# EAGLE design Spannungsversorgung_V3 (EAGLE 9.6.2)
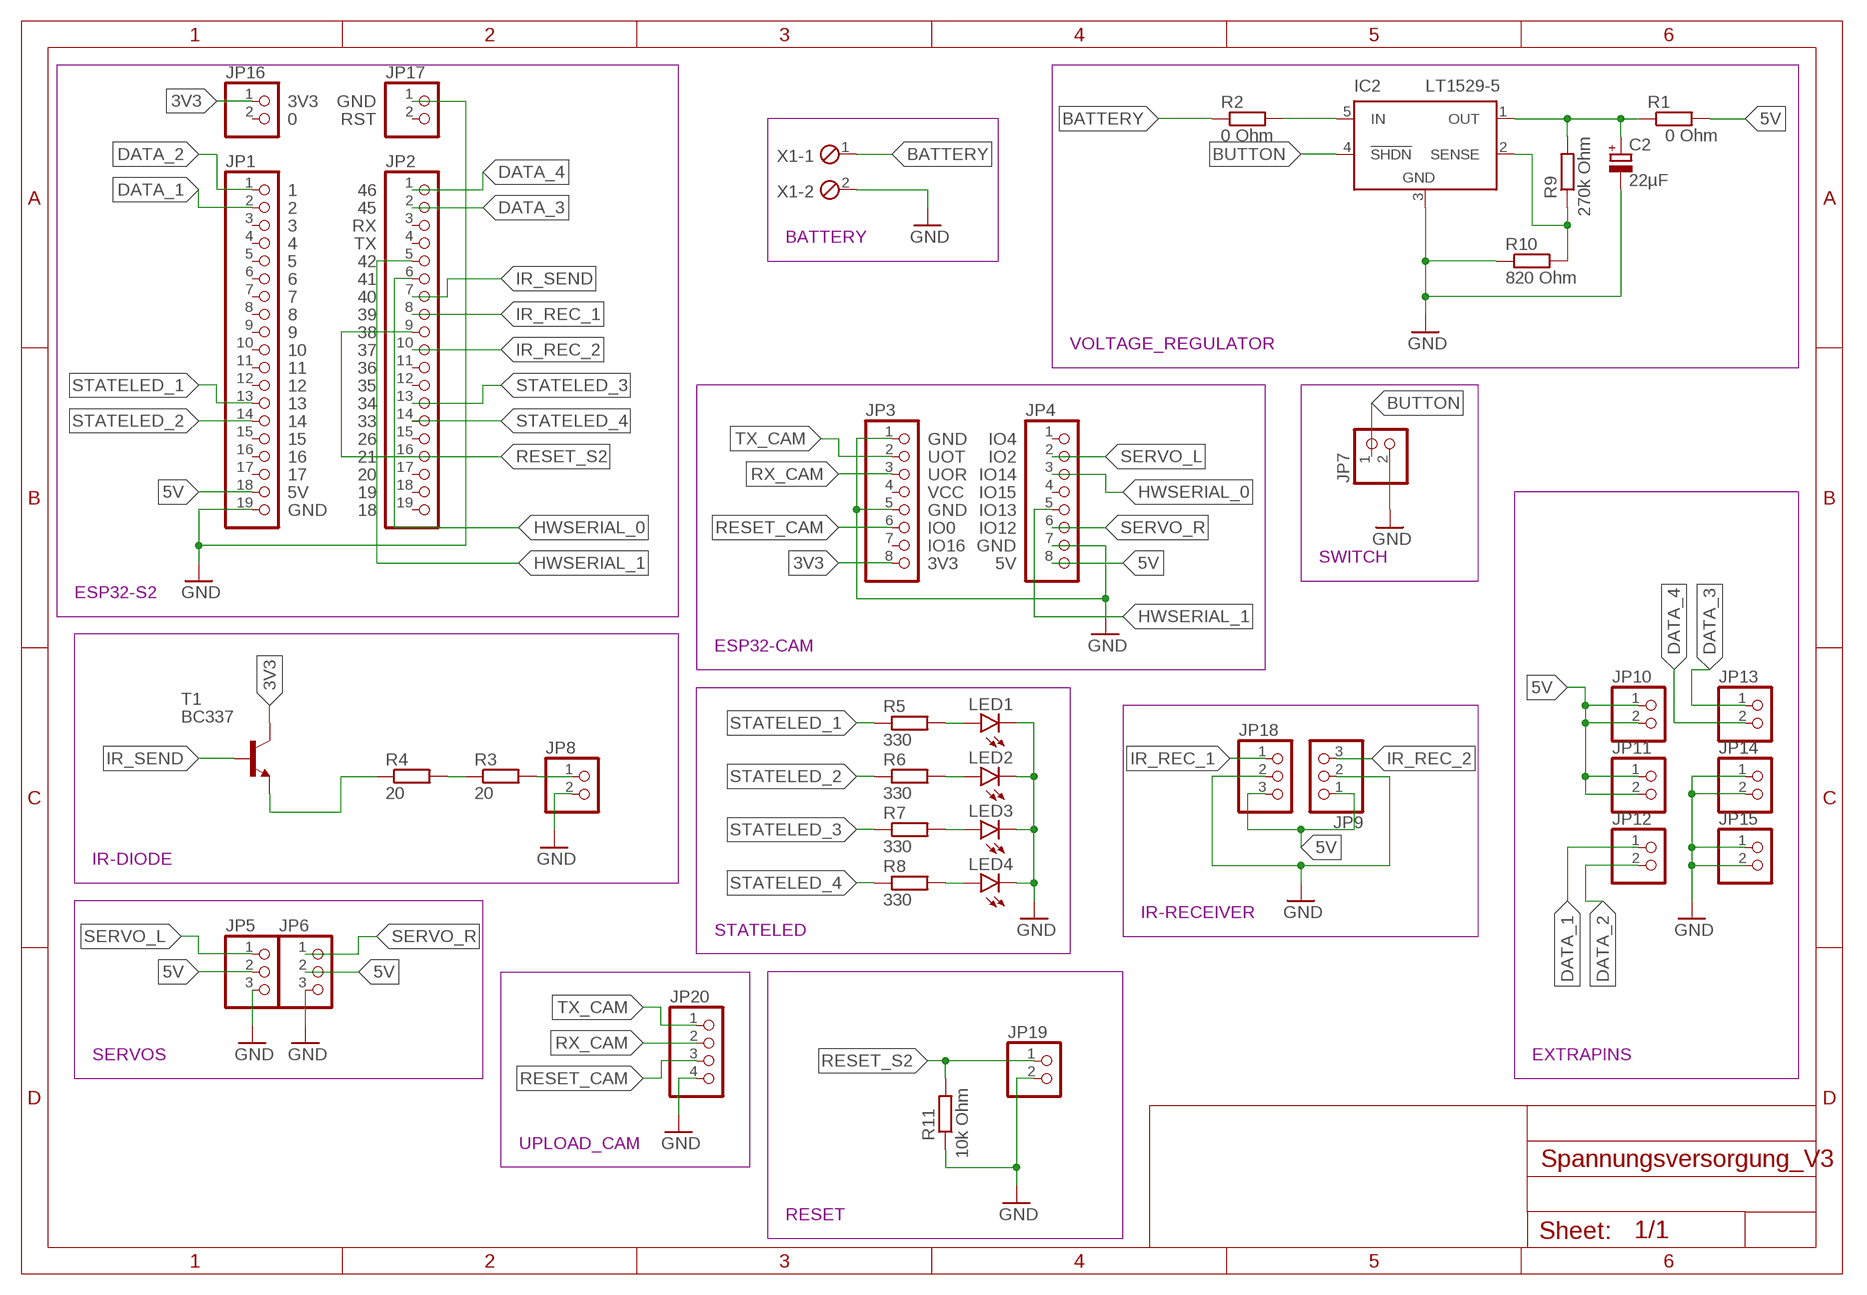
[diagram p0: schematic, sheet 1]

## Parts
C2  22µF  CPOL-EUE2.5-5  [E2,5-5]
IC2  LT1529-5  LT1529T  [TO220-5]
JP1  PINHD-1X19  [1X19]
JP2  PINHD-1X19  [1X19]
JP3  PINHD-1X8  [1X08]
JP4  PINHD-1X8  [1X08]
JP5  PINHD-1X3  [1X03]
JP6  PINHD-1X3  [1X03]
JP7  PINHD-1X2  [1X02]
JP8  PINHD-1X2  [1X02]
JP9  PINHD-1X3  [1X03]
JP10  PINHD-1X2  [1X02]
JP11  PINHD-1X2  [1X02]
JP12  PINHD-1X2  [1X02]
JP13  PINHD-1X2  [1X02]
JP14  PINHD-1X2  [1X02]
JP15  PINHD-1X2  [1X02]
JP16  PINHD-1X2  [1X02]
JP17  PINHD-1X2  [1X02]
JP18  PINHD-1X3  [1X03]
JP19  PINHD-1X2  [1X02]
JP20  PINHD-1X4  [1X04]
LED1  LED3MM  [LED3MM]
LED2  LED3MM  [LED3MM]
LED3  LED3MM  [LED3MM]
LED4  LED3MM  [LED3MM]
R1  0 Ohm  R-EU_R0805  [R0805]
R2  0 Ohm  R-EU_R0805  [R0805]
R3  20  R-EU_0309/12  [0309/12]
R4  20  R-EU_0309/12  [0309/12]
R5  330  R-EU_R0805  [R0805]
R6  330  R-EU_R0805  [R0805]
R7  330  R-EU_R0805  [R0805]
R8  330  R-EU_R0805  [R0805]
R9  270k Ohm  R-EU_0309/12  [0309/12]
R10  820 Ohm  R-EU_0309/12  [0309/12]
R11  10k Ohm  R-EU_0309/12  [0309/12]
T1  BC337  [TO92]
X1  MPT2  [2POL254]

## Nets
3V3: JP3.8 JP16.1 T1.3(C)
5V: JP1.18 JP4.8 JP5.2 JP6.2 JP9.1 JP10.1 JP10.2 JP11.1 JP11.2 JP18.3 R1.2
BATTERY: R2.1 X1.1
BUTTON: IC2.4(!SHDN) JP7.1
DATA_1: JP1.2 JP12.1
DATA_2: JP1.1 JP12.2
DATA_3: JP2.2 JP13.1
DATA_4: JP2.1 JP13.2
GND: C2.- IC2.3(GND) JP1.19 JP3.1 JP3.5 JP4.7 JP5.3 JP6.3 JP7.2 JP8.2 JP9.2 JP14.1 JP14.2 JP15.1 JP15.2 JP17.1 JP18.2 JP19.2 JP20.4 LED1.K(C) LED2.K(C) LED3.K(C) LED4.K(C) R10.1 R11.1 X1.2
HWSERIAL_0: JP2.6 JP4.3
HWSERIAL_1: JP2.5 JP4.5
IR_REC_1: JP2.8 JP18.1
IR_REC_2: JP2.10 JP9.3
IR_SEND: JP2.7 T1.2(B)
N$1: R3.1 R4.2
N$2: JP8.1 R3.2
N$3: IC2.5(IN) R2.2
N$5: LED1.A R5.2
N$6: LED2.A R6.2
N$7: LED3.A R7.2
N$8: LED4.A R8.2
N$11: R4.1 T1.1(E)
N$13: IC2.2(SENSE) R9.1 R10.2
N$14: C2.+ IC2.1(OUT) R1.1 R9.2
RESET_CAM: JP3.6 JP20.3
RESET_S2: JP2.9 JP19.1 R11.2
RX_CAM: JP3.3 JP20.2
SERVO_L: JP4.2 JP5.1
SERVO_R: JP4.6 JP6.1
STATELED_1: JP1.13 R5.1
STATELED_2: JP1.14 R6.1
STATELED_3: JP2.13 R7.1
STATELED_4: JP2.14 R8.1
TX_CAM: JP3.2 JP20.1
Unconnected: JP1.3 JP1.4 JP1.5 JP1.6 JP1.7 JP1.8 JP1.9 JP1.10 JP1.11 JP1.12 JP1.15 JP1.16 JP1.17 JP2.3 JP2.4 JP2.11 JP2.12 JP2.15 JP2.16 JP2.17 JP2.18 JP2.19 JP3.4 JP3.7 JP4.1 JP4.4 JP16.2 JP17.2

## Notes on the sheet
- 3V3 | GND
- 0 | RST
- 1 | 46
- 2 | 45
- 3 | RX
- BATTERY
- 4 | TX
- 5 | 42
- 6 | 41
- 7 | 40
- 8 | 39
- 9 | 38
- VOLTAGE_REGULATOR
- 10 | 37
- 11 | 36
- 12 | 35
- 13 | 34
- 14 | 33
- 15 | 26 | GND | IO4
- 16 | 21 | UOT | IO2
- 17 | 20 | UOR | IO14
- 5V | 19 | VCC | IO15
- GND | 18 | GND | IO13
- IO0 | IO12
- IO16 | GND
- SWITCH
- 3V3 | 5V
- ESP32-S2
- ESP32-CAM
- IR-DIODE
- IR-RECEIVER
- STATELED
- SERVOS | EXTRAPINS
- UPLOAD_CAM
- RESET

## Library data of the parts
C2 = rcl:CPOL-EU: POLARIZED CAPACITOR, European symbol; SPICEPREFIX: C
IC2 = ltc1440_lt1529_ds1302:LT1529: LT1529 5 Volt LDO Regulator 5 Volt, 3 Ampere Low Dropout voltage regulator.
JP1 JP2 = pinhead:PINHD-1X19: PIN HEADER
JP3 JP4 = pinhead:PINHD-1X8: PIN HEADER
JP5 JP6 JP9 JP18 = pinhead:PINHD-1X3: PIN HEADER
JP7 JP8 JP10-JP17 JP19 = pinhead:PINHD-1X2: PIN HEADER
JP20 = pinhead:PINHD-1X4: PIN HEADER
LED1-LED4 = led:LED: LED OSRAM: - CHIPLED LG R971, LG N971, LY N971, LG Q971, LY Q971, LO R971, LY R971 LH N974, LH R974 LS Q976, LO Q976, LY Q976 LO Q996 - Hyper CHIPLED LW Q18S LB Q993, LB Q99A, LB R99A - SideLED LS A670, LO A670, LY A670, LG A670, LP A670 LB A673, LV A673, LT A673, LW A673 LH A674 LY A675 LS A676, LA A676, LO A676, LY A676, LW A676 LS A679, LY A679, LG A679 - Hyper Micro SIDELED® LS Y876, LA Y876, LO Y876, LY Y876 LT Y87S - SmartLED LW L88C, LW L88S LB L89C, LB L89S, LG L890 LS L89K, LO L89K, LY L89K LS L896, LA L896, LO L896, LY L896 - TOPLED LS T670, LO T670, LY T670, LG T670, LP T670 LSG T670, LSP T670, LSY T670, LOP T670, LYG T670 LG T671, LOG T671, LSG T671 LB T673, LV T673, LT T673, LW T673 LH T674 LS T676, LA T676, LO T676, LY T676, LB T676, LH T676, LSB T676, LW T676 LB T67C, LV T67C, LT T67C, LS T67K, LO T67K, LY T67K, LW E67C LS E67B, LA E67B, LO E67B, LY E67B, LB E67C, LV E67C, LT E67C LW T67C LS T679, LY T679, LG T679 LS T770, LO T770, LY T770, LG T770, LP T770 LB T773, LV T773, LT T773, LW T773 LH T774 LS E675, LA E675, LY E675, LS T675 LS T776, LA T776, LO T776, LY T776, LB T776 LHGB T686 LT T68C, LB T68C - Hyper Mini TOPLED® LB M676 - Mini TOPLED Santana® LG M470 LS M47K, LO M47K, LY M47K Source: http://www.osram.convergy.de LUXEON: - LUMILED® LXK2-PW12-R00, LXK2-PW12-S00, LXK2-PW14-U00, LXK2-PW14-V00 LXK2-PM12-R00, LXK2-PM12-S00, LXK2-PM14-U00 LXK2-PE12-Q00, LXK2-PE12-R00, LXK2-PE12-S00, LXK2-PE14-T00, LXK2-PE14-U00 LXK2-PB12-K00, LXK2-PB12-L00, LXK2-PB12-M00, LXK2-PB14-N00, LXK2-PB14-P00, LXK2-PB14-Q00 LXK2-PR12-L00, LXK2-PR12-M00, LXK2-PR14-Q00, LXK2-PR14-R00 LXK2-PD12-Q00, LXK2-PD12-R00, LXK2-PD12-S00 LXK2-PH12-R00, LXK2-PH12-S00 LXK2-PL12-P00, LXK2-PL12-Q00, LXK2-PL12-R00 Source: www.luxeon.com KINGBRIGHT: KA-3528ASYC Source: www.kingbright.com
R1-R11 = rcl:R-EU_: RESISTOR, European symbol; SPICEPREFIX: R
T1 = transistor:BC337: NPN TRANSISTOR
X1 = con-phoenix-254:MPT2: PHOENIX CONNECTOR; OC_FARNELL: unknown; OC_NEWARK: unknown

## Board
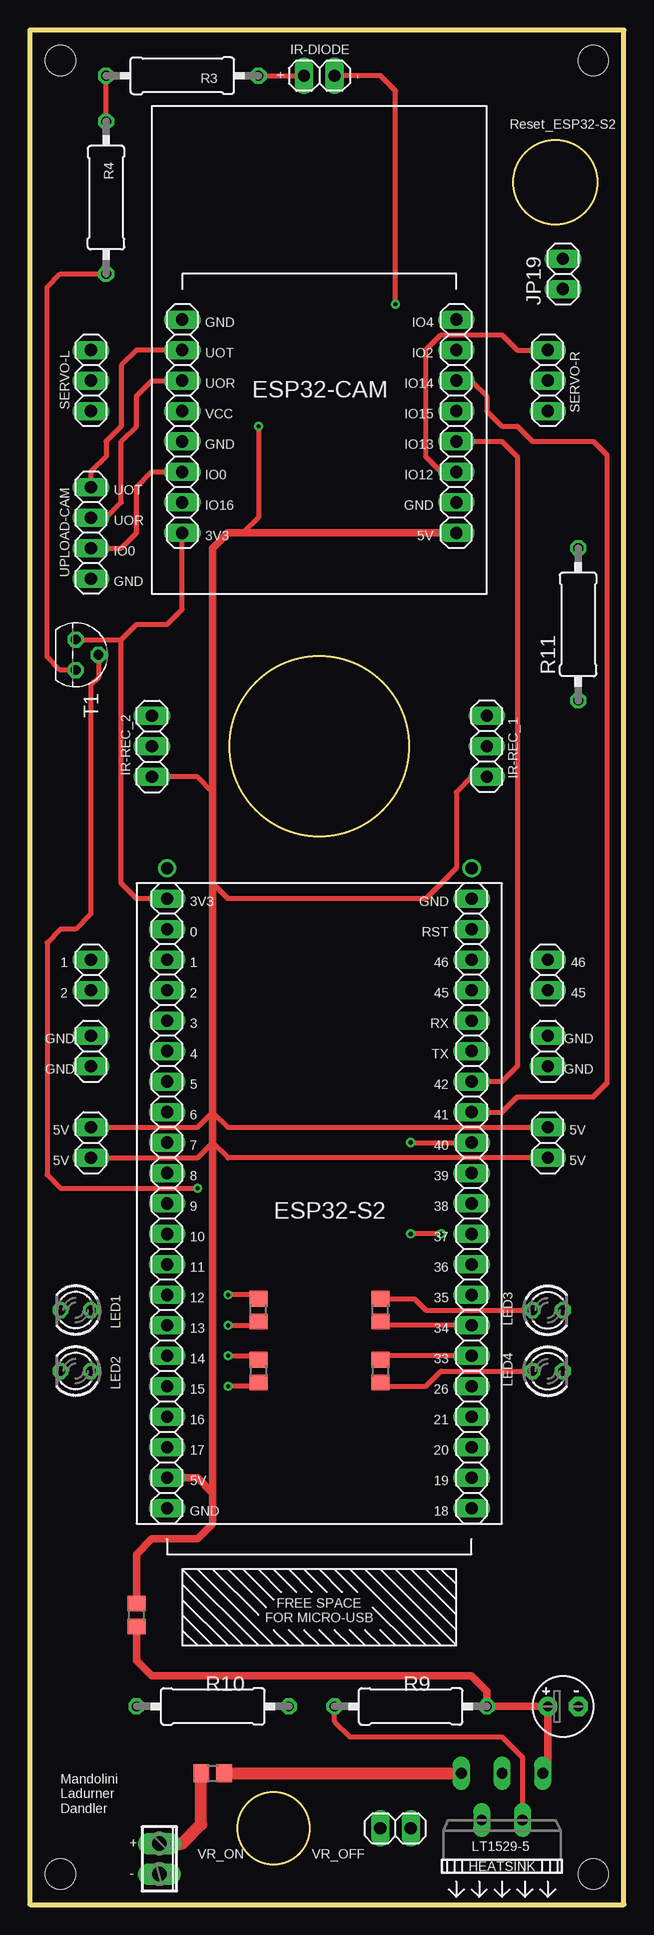
[diagram p1: board, top side]
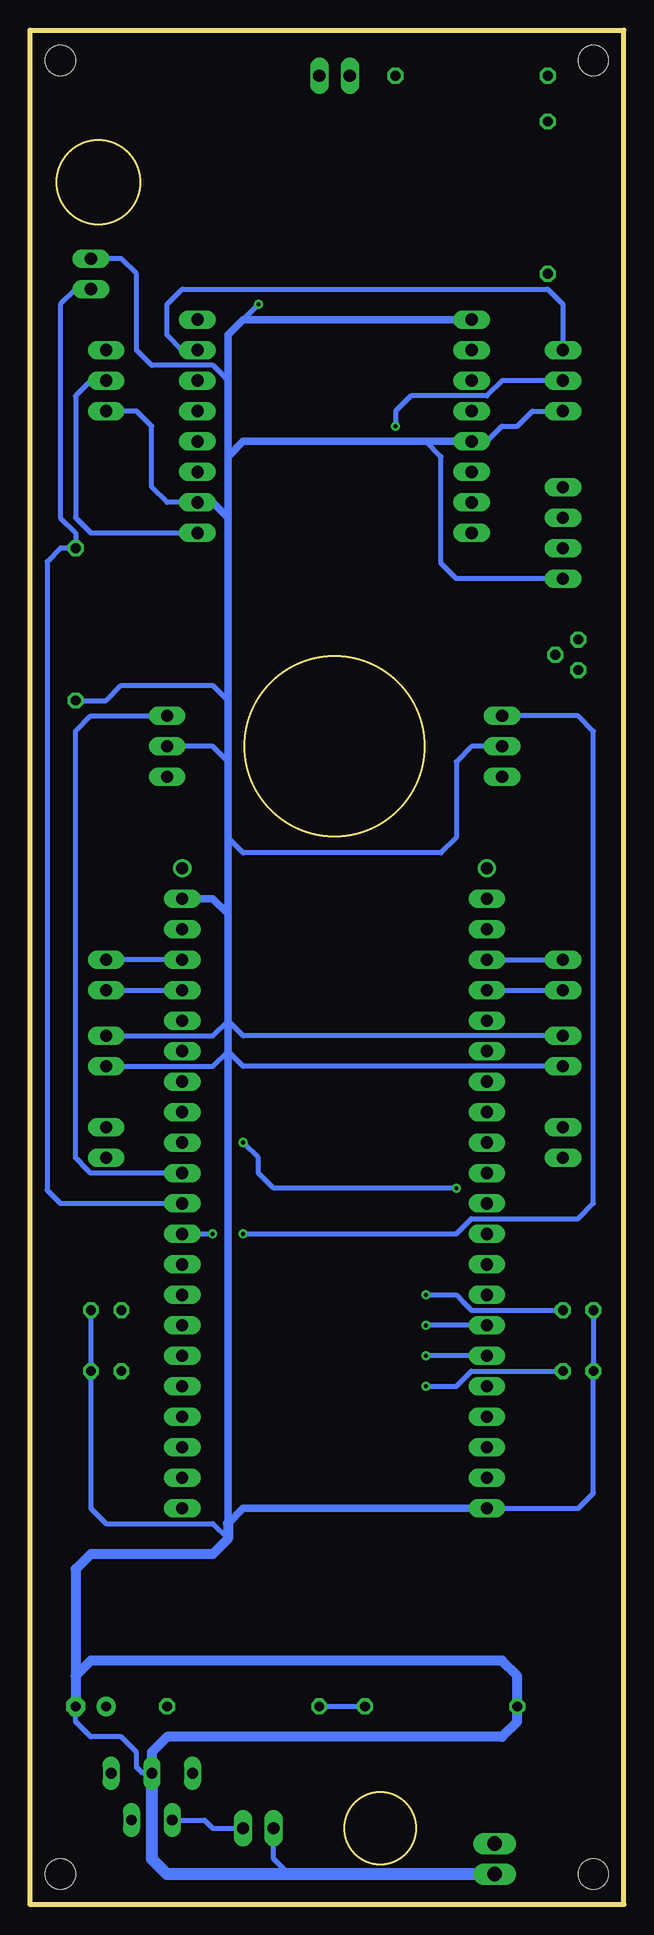
[diagram p2: board, bottom side, seen from below]

Size 49.53 x 156.21 mm. Coordinates in mm from the lower left corner, seen from the top.
Outline: 0,0 49.53,0 49.53,156.21 0,156.21 0,0
Copper layers (1*16): Top 0.035mm / dielectric 1.5mm / Bottom 0.035mm
Design rules "default *": minimum track width 6mil, minimum drill 0.35mm, track to track 12mil, track to pad 12mil, pad to pad 12mil, via to via 12mil, smd to smd 12mil, copper to edge 40mil, drill to drill 12mil, minimum pad ring 10mil, minimum via ring 8mil, stop-mask expansion 4mil, vias tented up to drill 0mil, thermal gap 10mil
Holes 2.5 mm at 2.54,153.67 46.99,153.67 2.54,2.54 46.99,2.54
Milling: area 16.6,89 to 31.6,104; area 17.3,3.4 to 23.3,9.3; area 40.3,140 to 47.3,147

### Footprints (pad centres in the part's own frame; a part is rotated, then mirrored left to right if it is on the bottom)
E2,5-5 = drill 0.813 pad 1.6: + -1.27,0 | drill 0.813 pad 1.6 octagon: - 1.27,0
TO220-5 = drill 0.9 long: 1 -3.4,-8.4; 2 -1.7,-4.5; 3 0,-8.4; 4 1.7,-4.5; 5 3.4,-8.4
1X19 = drill 1.016 long: 1 -22.86,0; 2 -20.32,0; 3 -17.78,0; 4 -15.24,0; 5 -12.7,0; 6 -10.16,0; 7 -7.62,0; 8 -5.08,0; 9 -2.54,0; 10 0,0; 11 2.54,0; 12 5.08,0; 13 7.62,0; 14 10.16,0; 15 12.7,0; 16 15.24,0; 17 17.78,0; 18 20.32,0; 19 22.86,0
1X08 = drill 1.016 long: 1 -8.89,0; 2 -6.35,0; 3 -3.81,0; 4 -1.27,0; 5 1.27,0; 6 3.81,0; 7 6.35,0; 8 8.89,0
1X03 = drill 1.016 long: 1 -2.54,0; 2 0,0; 3 2.54,0
1X02 = drill 1.016 long: 1 -1.27,0; 2 1.27,0
1X04 = drill 1.016 long: 1 -3.81,0; 2 -1.27,0; 3 1.27,0; 4 3.81,0
LED3MM = drill 0.813 octagon: A -1.27,0; K 1.27,0
R0805 = smd 1.3 x 1.5: 1 -0.95,0; 2 0.95,0
0309/12 = drill 0.813 octagon: 1 -6.35,0; 2 6.35,0
TO92 = drill 0.813 octagon: 1 1.27,0; 2 0,1.905; 3 -1.27,0
2POL254 = drill 1.2 long: 1 -1.27,0; 2 1.27,0

### Placement (x,y rotation side)
C2  44.45,16.51 0 top
IC2  39.37,2.54 180 top
JP1  11.43,55.88 270 top
JP2  36.83,55.88 270 top
JP3  12.7,123.19 270 top
JP4  35.56,123.19 270 top
JP5  5.08,127 270 top
JP6  43.18,127 270 top
JP7  30.48,6.35 180 top
JP8  24.13,152.4 0 top
JP9  10.16,96.52 90 top
JP10  5.08,63.5 90 top
JP11  43.18,63.5 90 top
JP12  5.08,77.47 90 top
JP13  43.18,77.47 90 top
JP14  5.08,71.12 90 top
JP15  43.18,71.12 90 top
JP16  11.43,82.55 270 top
JP17  36.83,82.55 270 top
JP18  38.1,96.52 270 top
JP19  44.45,135.89 90 top
JP20  5.08,114.3 270 top
LED1  3.81,49.53 180 top
LED2  3.81,44.45 180 top
LED3  43.18,49.53 0 top
LED4  43.18,44.45 0 top
R1  8.89,24.13 90 top
R2  15.24,10.93 0 top
R3  12.7,152.4 0 top
R4  6.35,142.24 90 top
R5  19.05,49.53 90 top
R6  19.05,44.45 270 top
R7  29.21,49.53 90 top
R8  29.21,44.45 270 top
R9  31.75,16.51 0 top
R10  15.24,16.51 0 top
R11  45.72,106.68 90 top
T1  3.81,104.14 270 top
X1  10.79,3.81 270 top

### Tracks (layer width: path | path; a pad name or v marks a point on that pad's centre or on a via)
3V3
  Top 0.406: 7.62,105.41 7.62,85.09 8.89,83.82 JP16.1 | 7.62,105.41 8.89,106.68 11.43,106.68 12.7,107.95 JP3.8 | T1.3 7.62,105.41
5V  (via drill 0.35)
  Top 0.406: JP10.2 13.97,64.77 15.24,66.04 16.51,64.77 JP11.2 | JP10.1 13.97,62.23 15.24,63.5 16.51,62.23 JP11.1 | 15.24,92.71 13.97,93.98 JP9.1 | 15.24,85.09 16.51,83.82 33.02,83.82 35.56,86.36 35.56,92.71 36.83,93.98 JP18.3 | v19.05,123.19 19.05,115.57 17.78,114.3
  Top 0.61: R1.2 8.89,29.21 10.16,30.48 13.97,30.48 15.24,31.75 15.24,34.29 | JP4.8 17.78,114.3 16.51,114.3 15.24,113.03 15.24,92.71 15.24,85.09 15.24,66.04 15.24,63.5 15.24,34.29 | 15.24,34.29 13.97,35.56 JP1.18
  Bottom 0.406: JP6.2 44.45,127 45.72,125.73 45.72,115.57 44.45,114.3 JP4.8 | JP5.2 10.14,127 11.41,125.73 17.78,125.73 19.05,124.46 v19.05,123.19
BATTERY
  Top 1.016: X1.1 12.7,5.08 14.29,6.67 R2.1
BUTTON
  Bottom 0.406: IC2.4 34.98,7.04 34.29,6.35 JP7.1
DATA_1
  Bottom 0.406: JP1.2 JP12.1
DATA_2
  Bottom 0.406: JP1.1 JP12.2
DATA_3
  Bottom 0.406: JP13.1 JP2.2
DATA_4
  Bottom 0.406: JP2.1 JP13.2
GND  (via drill 0.35)
  Top 0.406: v30.48,133.35 30.48,151.13 29.21,152.4 JP8.2
  Bottom 0.406: 27.94,2.54 29.21,3.81 JP7.2 | IC2.3 40.15,10.94 40.64,11.43 40.64,12.7 41.91,13.97 44.45,13.97 45.72,15.24 C2.- | JP14.2 31.75,72.39 33.02,73.66 34.29,72.39 JP15.2 | JP14.1 31.75,69.85 33.02,71.12 34.29,69.85 JP15.1 | 33.02,95.25 34.29,96.52 JP18.2 | JP9.2 12.7,96.52 13.97,95.25 13.97,88.9 15.24,87.63 31.75,87.63 33.02,88.9 | LED1.K LED2.K 2.54,34.29 3.81,33.02 JP1.19 | LED3.K LED4.K 44.45,33.02 43.18,31.75 34.29,31.75 33.02,30.48 | JP4.7 38.1,116.84 39.37,118.11 39.37,123.19 40.64,124.46 JP6.3 | JP3.5 11.43,121.92 10.16,123.19 8.89,123.19 7.62,124.46 JP5.3 | JP20.4 13.97,110.49 15.24,111.76 15.24,120.65 16.51,121.92 | 31.75,132.08 v30.48,133.35 | 33.02,127 33.53,127.51 33.53,127.53 34.27,128.27 39.37,128.27 40.64,129.54 40.64,135.89 41.91,137.16 JP19.2 | R11.1 43.18,100.33 41.91,101.6 34.29,101.6 33.02,100.33
  Bottom 0.61: JP4.7 34.29,116.84 33.02,115.57 | 33.02,115.57 33.02,100.33 33.02,95.25 33.02,88.9 33.02,82.55 | 33.02,82.55 33.02,73.66 33.02,71.12 33.02,31.75 31.75,33.02 JP1.19 | JP17.1 34.29,83.82 33.02,82.55 | 33.02,120.65 33.02,127 33.02,130.81 31.75,132.08 JP3.1 | 33.02,120.65 33.02,115.57 | JP3.5 16.51,121.92 31.75,121.92 33.02,120.65
  Bottom 0.813: IC2.3 39.37,12.7 38.1,13.97 10.16,13.97 8.89,15.24 R10.1 8.89,19.05 10.16,20.32 44.45,20.32 45.72,19.05 | 33.02,31.75 33.02,30.48 34.29,29.21 44.45,29.21 45.72,27.94 45.72,19.05 | 45.72,19.05 C2.-
  Bottom 1.016: IC2.3 39.37,3.81 38.1,2.54 27.94,2.54 X1.2
HWSERIAL_0
  Top 0.406: JP2.6 39.37,66.04 40.64,67.31 46.99,67.31 48.11,68.43 48.11,120.8 46.99,121.92 41.91,121.92 40.64,123.19 39.37,123.19 38.1,124.46 38.1,125.73 36.83,127 JP4.3
HWSERIAL_1
  Top 0.406: JP4.5 39.37,121.92 40.64,120.65 40.64,69.85 39.37,68.58 JP2.5
IR_REC_1
  Bottom 0.406: JP18.1 44.45,99.06 45.72,97.79 45.72,62.23 45.21,61.72 45.21,61.7 44.47,60.96 JP2.8
IR_REC_2  (via drill 0.35)
  Top 0.406: v34.29,55.88 v31.75,55.88
  Bottom 0.406: JP2.10 v34.29,55.88 | v31.75,55.88 13.97,55.88 13.46,56.39 13.46,56.41 12.72,57.15 3.81,57.15 2.54,58.42 2.54,97.79 3.81,99.06 JP9.3
IR_SEND  (via drill 0.35)
  Top 0.406: T1.2 5.71,102.23 5.08,101.6 5.08,82.55 3.81,81.28 2.54,81.28 1.42,80.16 1.42,60.81 2.54,59.69 v13.97,59.69 | v31.75,63.5 JP2.7
  Bottom 0.406: v31.75,63.5 30.48,62.23 30.48,60.96 29.21,59.69 v13.97,59.69
N$1
  Top 0.406: R4.2 R3.1
N$2
  Top 0.406: R3.2 JP8.1
N$3
  Top 1.016: R2.2 IC2.5
N$5  (via drill 0.35)
  Top 0.406: R5.2 18.73,50.8 v16.51,50.8
  Bottom 0.406: v16.51,50.8 13.97,50.8 13.46,50.29 13.46,50.27 12.72,49.53 LED1.A
N$6  (via drill 0.35)
  Top 0.406: R6.2 18.73,43.18 v16.51,43.18
  Bottom 0.406: v16.51,43.18 13.97,43.18 13.46,43.69 13.46,43.71 12.72,44.45 LED2.A
N$7
  Top 0.406: R7.2 32.07,50.48 33.02,49.53 LED3.A
N$8
  Top 0.406: R8.2 29.53,43.18 33.02,43.18 34.29,44.45 LED4.A
N$9  (via drill 1.02)
  other vias: 36.83,86.36
N$10  (via drill 1.02)
  other vias: 11.43,86.36
N$11
  Top 0.406: T1.1 2.54,102.87 1.42,103.99 1.42,134.77 2.54,135.89 R4.1
N$13
  Top 0.406: R9.1 25.4,15.24 26.67,13.97 39.37,13.97 41.07,12.27 IC2.2
  Bottom 0.406: R9.1 R10.2
N$14
  Top 0.61: IC2.1 43.18,11.35 C2.+ R9.2 38.1,17.78 36.83,19.05 10.16,19.05 8.89,20.32 R1.1
RESET_CAM
  Top 0.406: JP3.6 10.16,119.38 8.89,118.11 8.89,114.3 7.62,113.03 JP20.3
RESET_S2
  Bottom 0.406: JP19.1 45.72,134.62 46.99,133.35 46.99,115.57 45.72,114.3 R11.2 46.99,113.03 48.11,111.91 48.11,59.54 46.99,58.42 JP2.9
RX_CAM
  Top 0.406: JP20.2 6.35,115.57 7.62,116.84 7.62,121.92 8.89,123.19 8.89,125.73 10.16,127 JP3.3
SERVO_L
  Bottom 0.406: JP4.2 36.83,129.54 38.1,130.81 38.1,133.35 36.83,134.62 6.35,134.62 5.08,133.35 JP5.1
SERVO_R
  Top 0.406: JP4.6 34.29,119.38 33.02,120.65 33.02,129.56 34.27,130.81 39.37,130.81 40.64,129.54 JP6.1
STATELED_1  (via drill 0.35)
  Top 0.406: v16.51,48.26 18.73,48.26 R5.1
  Bottom 0.406: JP1.13 v16.51,48.26
STATELED_2  (via drill 0.35)
  Top 0.406: v16.51,45.72 18.73,45.72 R6.1
  Bottom 0.406: JP1.14 v16.51,45.72
STATELED_3
  Top 0.406: R7.1 29.53,48.26 JP2.13
STATELED_4
  Top 0.406: R8.1 29.53,45.72 JP2.14
TX_CAM
  Top 0.406: JP3.2 8.89,129.54 7.62,128.27 7.62,123.19 6.35,121.92 6.35,120.65 5.08,119.38 JP20.1

### Text on the board
tPlace: ESP32-CAM | ESP32-S2
tNames: IR-DIODE | + | - | Reset_ESP32-S2 | GND | IO4 | UOT | IO2 | UOR | IO14 | SERVO-L | VCC | IO15 | SERVO-R | GND | IO13 | IO0 | IO12 | UOT | IO16 | GND | UOR | 3V3 | 5V | IO0 | UPLOAD-CAM | GND | IR-REC_1 | IR-REC_2 | 3V3 | GND | 0 | RST | 1 | 1 | 46 | 46 | 2 | 2 | 45 | 45 | 3 | RX | GND | GND | 4 | TX | GND | GND | 5 | 42 | 6 | 41 | 5V | 5V | 7 | 40 | 5V | 5V | 8 | 39 | 9 | 38 | 10 | 37 | 11 | 36 | 12 | 35 | 13 | 34 | 14 | 33 | 15 | 26 | 16 | 21 | 17 | 20 | 5V | 19 | GND | 18 | FREE SPACE / FOR MICRO-USB | Mandolini / Ladurner / Dandler | + | VR_ON | VR_OFF | HEATSINK | -